# Altium schematic sheet TEST-GPS_RF-REV-C.SchDoc: Test Board for altimeter, RF, GPS,
size 419 x 297 mm; Organization: FFT; Revision: C; SheetNumber: 1; SheetTotal: 1; ID: TESET-GPS_RF
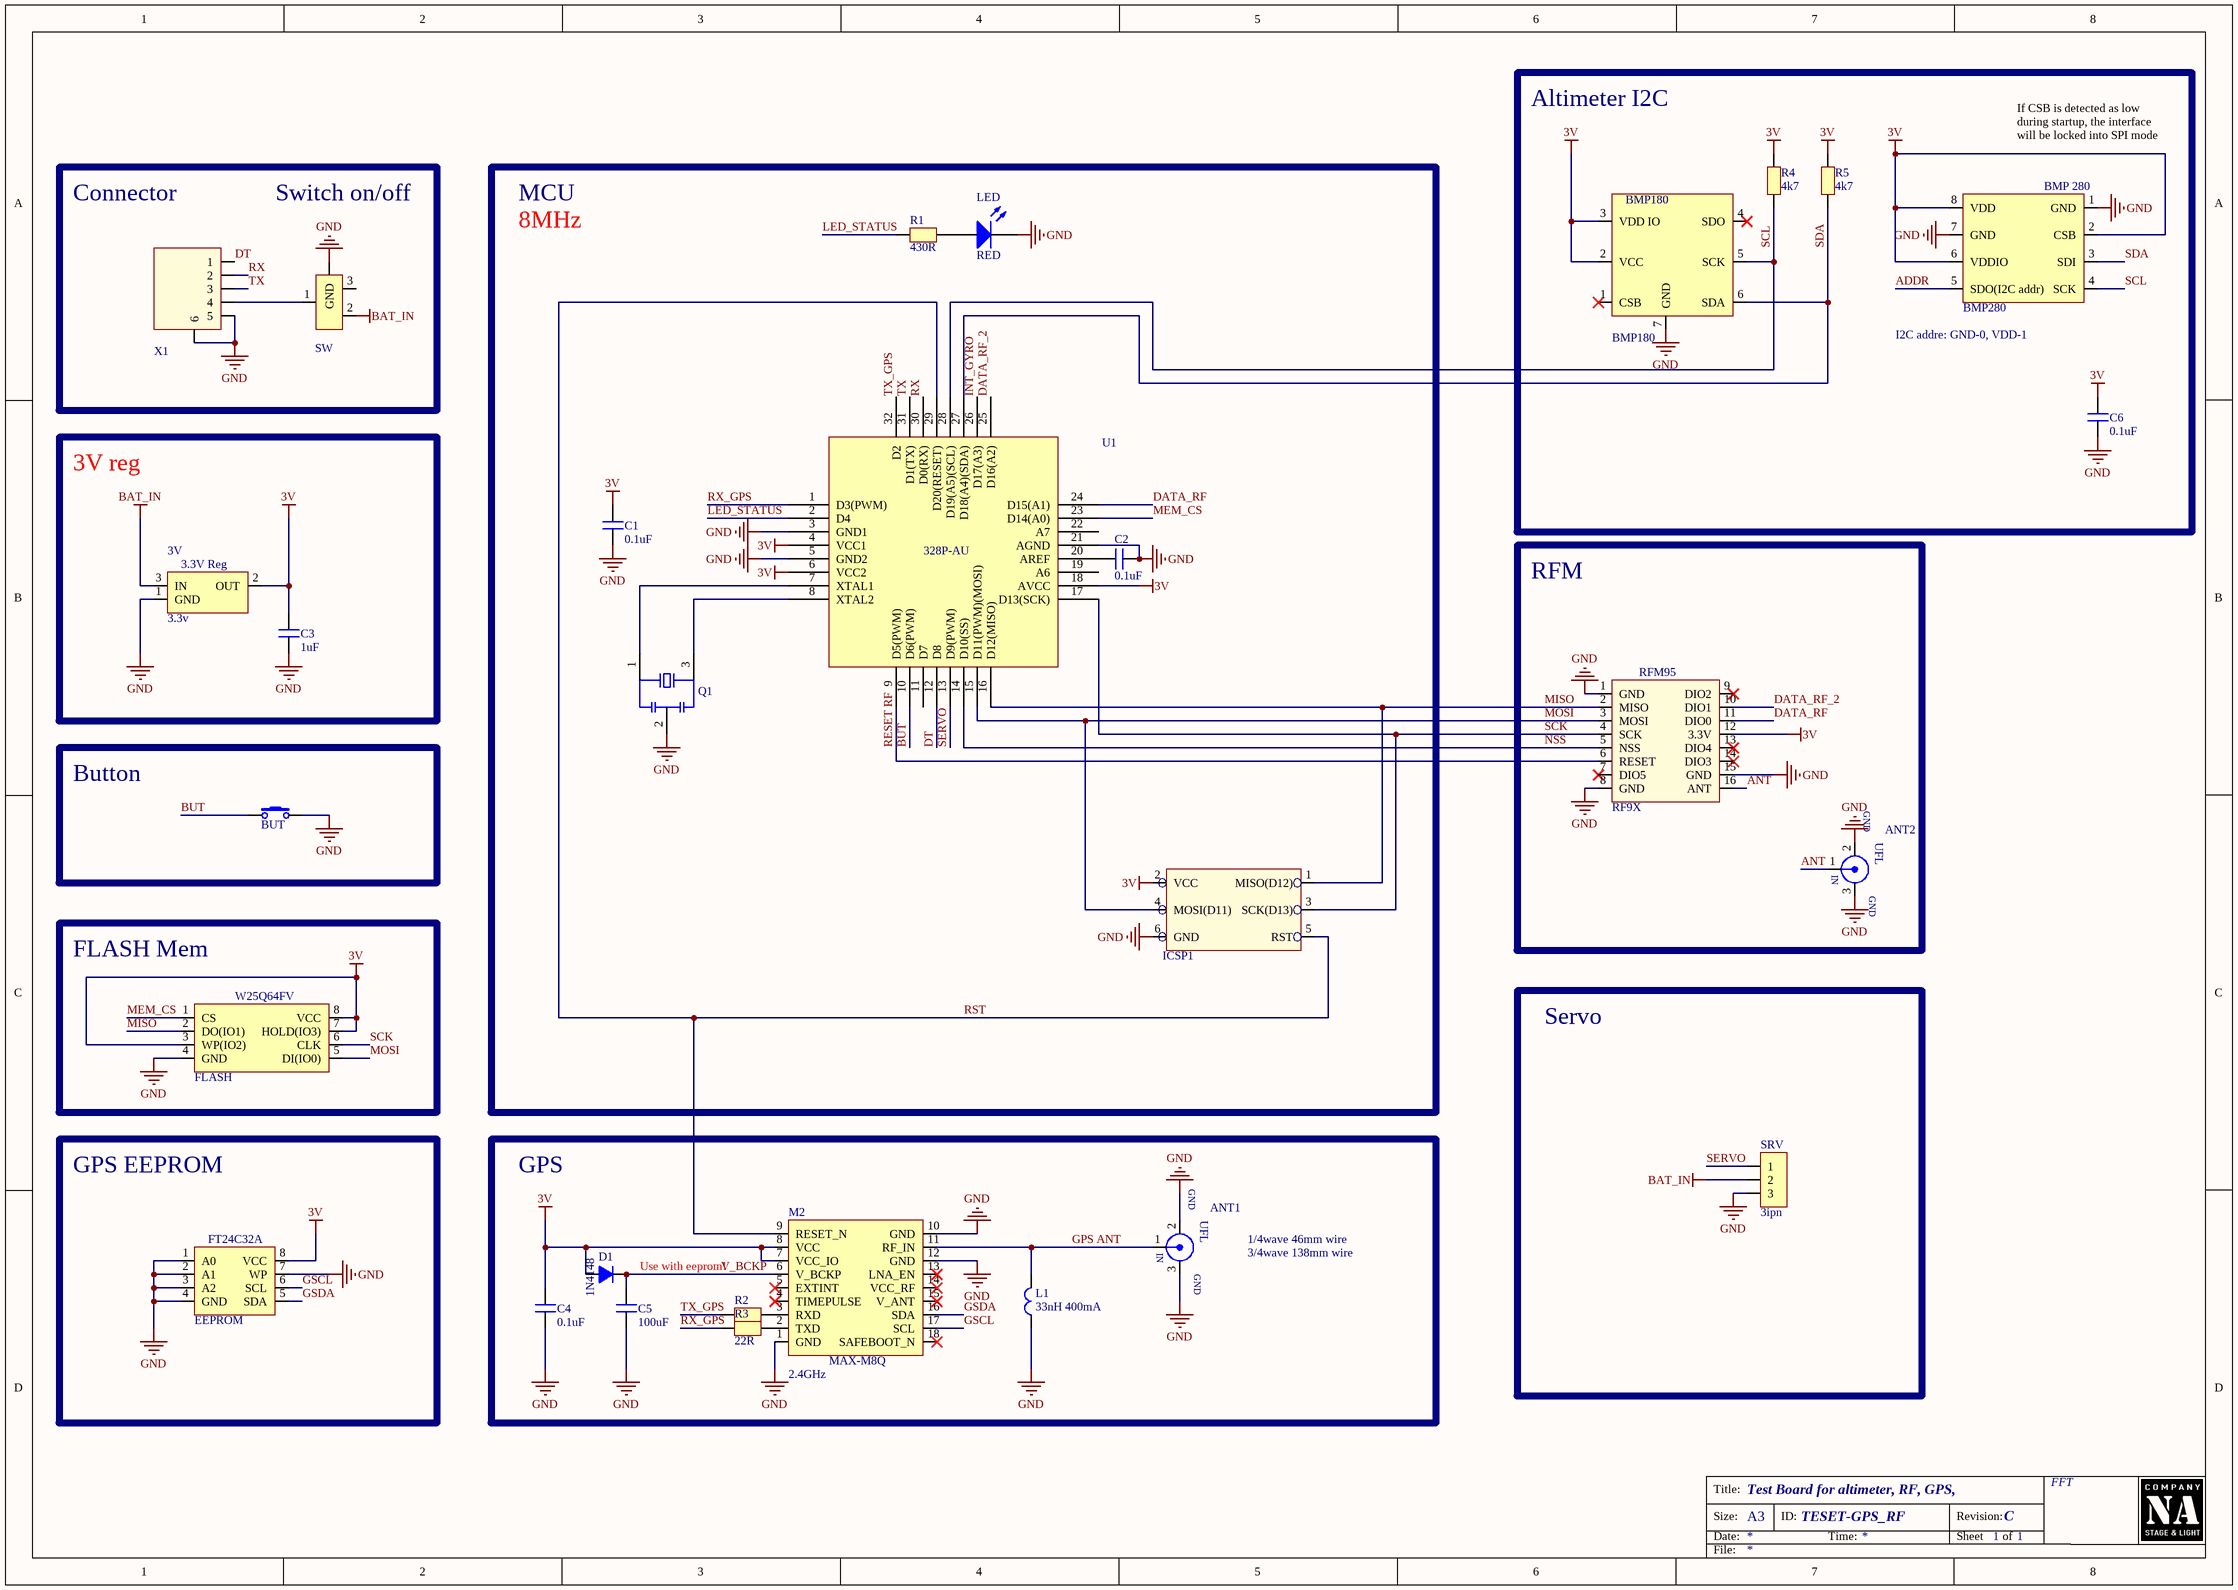
[diagram p0: TEST-GPS_RF-REV-C.SchDoc]

## Parts
3V  3.3v  [SOT23-3]
ANT1  UFL-simple  [UFL]  (value not drawn)
ANT2  UFL-simple  [UFL]  (value not drawn)
BMP180  ± 0.12 hPa equivalent to ±1 m  [BMP180]  (value not drawn)
BMP280  ± 0.12 hPa equivalent to ±1 m  [BMP280]  (value not drawn)
BUT  B3S-1002  [B3S-1002 FFT]  (value not drawn)
C1  0.1uF  [C0603]
C2  0.1uF  [C0603]
C3  1uF  [C0603]
C4  0.1uF  [C0603]
C5  100uF  [C1210]
C6  0.1uF  [C0603]
D1  1N4148  [SOD-323]
EEPROM  32KBit  [TSSOP - 8]  (value not drawn)
FLASH  -  [VSOP8]  (value not drawn)
ICSP1  Progr ICSP  [ICSP prg PAD 2.54mm]  (value not drawn)  (net tie)
L1  33nH 400mA  [L0603]
LED  RED  [LED0603]
M2  2.4GHz  [MAX-M8Q]
Q1  osc 8Mhz CSTCE8M0V53-R0_1  [OSC_CSTCE16M0V53-R0]  (value not drawn)
R1  430R  [0603]
R2  22R  [0603]
R3  22R  [0603]
R4  4k7  [0603]
R5  4k7  [0603]
RF9X  RFM95  [RFM9x]  (value not drawn)
SRV  3ipn  [HDR1x3 angled]
SW  (no value)  [Switch slide]
U1  (no value)  [32-pin QFP 10mm]
X1  1.0mm 5pin  [JST 5pin 1mm]  (value not drawn)

## Blocks framed on the sheet
Altimeter I2C: BMP180 BMP280 C6 R4 R5
3V reg: 3V C3
RFM: ANT2 RF9X
Button: BUT
FLASH Mem: FLASH
Servo: SRV
GPS EEPROM: EEPROM
GPS: ANT1 C4 C5 D1 L1 M2 R2 R3

## Nets
3V: 3V.2(OUT) BMP180.2(VCC) BMP180.3(VDD_IO) BMP280.2(CSB) BMP280.6(VDDIO) BMP280.8(VDD) C1.2 C3.2 C4.1 C6.2 D1.A EEPROM.8(VCC) FLASH.3(WP(IO2)) FLASH.7(HOLD(IO3)) FLASH.8(VCC) ICSP1.2(VCC) M2.7(VCC_IO) M2.8(VCC) R4.2 R5.2 RF9X.12(3.3V) U1.4(VCC1) U1.6(VCC2) U1.18(AVCC)
BAT_IN: 3V.3(IN) SRV.2 SW.2
GND: 3V.1(GND) ANT1.2(OUT) ANT1.3(GND) ANT2.2(OUT) ANT2.3(GND) BMP180.7(GND) BMP280.1(GND) BMP280.7(GND) BUT.1 C1.1 C2.1 C3.1 C4.2 C5.2 C6.1 EEPROM.1(A0) EEPROM.2(A1) EEPROM.3(A2) EEPROM.4(GND) EEPROM.7(WP) FLASH.4(GND) ICSP1.6(GND) L1.1 LED.2 M2.1(GND) M2.10(GND) M2.12(GND) Q1.2(OSC2) RF9X.1(GND) RF9X.8(GND) RF9X.15(GND) SRV.3 SW.4(GND) U1.3(GND1) U1.5(GND2) U1.21(AGND) X1.5 X1.6
ADDR: BMP280.5(SDO(I2C_addr))
ANT: ANT2.1(ANT) RF9X.16(ANT)
BUT: BUT.2 U1.10(D6(PWM))
DATA_RF: RF9X.11(DIO0) U1.24(D15(A1))
DATA_RF_2: RF9X.10(DIO1) U1.25(D16(A2))
DT: U1.12(D8) X1.1
GPS ANT: ANT1.1(ANT) L1.2 M2.11(RF_IN)
GSCL: EEPROM.6(SCL) M2.17(SCL)
GSDA: EEPROM.5(SDA) M2.16(SDA)
INT_GYRO: U1.26(D17(A3))
LED_STATUS: R1.1 U1.2(D4)
MEM_CS: FLASH.1(CS) U1.23(D14(A0))
MISO: FLASH.2(DO(IO1)) ICSP1.1(MISO(D12)) RF9X.2(MISO) U1.16(D12(MISO))
MOSI: FLASH.5(DI(IO0)) ICSP1.4(MOSI(D11)) RF9X.3(MOSI) U1.15(D11(PWM)(MOSI))
NSS: RF9X.5(NSS) U1.14(D10(SS))
RESET RF: RF9X.6(RESET) U1.9(D5(PWM))
RST: ICSP1.5(RST) M2.9(RESET_N) U1.29(D20(RESET))
RX: U1.30(D0(RX)) X1.2
RX_GPS: R3.1 U1.1(D3(PWM))
SCK: FLASH.6(CLK) ICSP1.3(SCK(D13)) RF9X.4(SCK) U1.17(D13(SCK))
SCL: BMP180.5(SCK) BMP280.4(SCK) R4.1 U1.28(D19(A5)(SCL))
SDA: BMP180.6(SDA) BMP280.3(SDI) R5.1 U1.27(D18(A4)(SDA))
SERVO: SRV.1 U1.13(D9(PWM))
TX: U1.31(D1(TX)) X1.3
TX_GPS: R2.1 U1.32(D2)
V_BCKP: C5.1 D1.K M2.6(V_BCKP)
NetC2_2: C2.2 U1.20(AREF)
NetLED_1: LED.1 R1.2
NetM2_2: M2.2(TXD) R3.2
NetM2_3: M2.3(RXD) R2.2
NetQ1_1: Q1.1(OSC1) U1.7(XTAL1)
NetQ1_3: Q1.3(OSC3) U1.8(XTAL2)
NetSW_1: SW.1 X1.4

Not connected (* = marked no-connect by the designer): BMP180 1(CSB)* 4(SDO)*; M2 4(TIMEPULSE)* 5(EXTINT)* 13(LNA_EN)* 14(VCC_RF)* 15(V_ANT)* 18(SAFEBOOT_N)*; RF9X 7(DIO5)* 9(DIO2)* 13(DIO4)* 14(DIO3)*; SW 3; U1 11(D7) 19(A6) 22(A7)

## Notes on the sheet
- If CSB is detected as low
  during startup, the interface will be locked into SPI mode
- Connector
- Switch on/off
- MCU
- 8MHz
- (near BMP280) I2C addre: GND-0, VDD-1
- Use with eeprom!
- 1/4wave 46mm wire
- 3/4wave 138mm wire
- Title:
- Size:
- Date:
- A3
- ID:
- Time:
- Revision:
- Sheet
- of
- File:
- (in symbol 328p-AU-arduino) 328P-AU
- (in symbol UFL - simple) UFL; IN
- (in symbol XC6206P332MR) 3.3V Reg

## Library data of the parts
3V = XC6206P332MR: LDO 3.3V 200mA; Part Footprint: SOT-23-3L; Manufacturer: TOREX; Part Description: LDO 3.3V 0.2A; Value: 3.3v; Part Number: XC6206P332MR; Price: 0.06; LCSC Part #: C5446
ANT1 ANT2 = UFL - simple: Connector; Manufacturer: Aliexpress; Part Description: ufl connector; Part Footprint: SMD; Part Number: 123123; Price: 0.1
BMP180 = BMP 180: Pressure sensor BMP 180; Part Description: BMP 180 Pressure sensor 1.62-3.6V; Manufacturer: BOSCH; Part Footprint: 3.6x3.8x0.93mm; Part Number: BMP 180; Value: ± 0.12 hPa equivalent to ±1 m; Price: 0.3
BMP280 = BMP 280: Pressure sensor BMP 280; Part Description: BMP 280 Pressure 3.4 μA,0.1 μA(sleep),1.2 ... 3.6 V; Manufacturer: BOSCH; Part Number: 828-1064-1-ND - BMP 280; Part Footprint: 2.0 x 2.5 x 0.95 mm³ 8-Pin LGA with metal; Value: ± 0.12 hPa equivalent to ±1 m; Price: 0.3
BUT = B3S-1002: Single pole tactile switch, H=4.2mm; Part Description: Sealed tactile switch, 1 to 50 mA, 5 to 24 VDC; Manufacturer: Omron; PartFootprint: SMD 6x6mm; Value: B3S-1002; Temperature: -25÷70°C; Part Number: B3S-1002; Packing: *; Tape width: *; MSD level: *
C1 C2 C4 C6 = C0603_0.1uF_50V: Part Number: CL10B104KB8NNNC; Part Description: CAP 0.1uF ±10% 50V X7R -55÷125°C 0603; Manufacturer: SAMSUNG; PartFootprint: 0603; Value2: 104; Percent: ±10%; Voltage: 50V; Dielectric: X7R; Name: CAP; Packing: Tape; MSD level: 2; Value: 0.1uF; Temperature: -55÷125°C; Tape width: 8mm
C3 = C0603_1uF_10V: Part Number: CL10A105KP8NNNC; Part Description: CAP 1uF ±10% 10V X5R -55÷85°C 0603; Manufacturer: SAMSUNG; PartFootprint: 0603; Value2: 105; Percent: ±10%; Voltage: 10V; Dielectric: X5R; Name: CAP; Packing: Tape; MSD level: 2; Value: 1uF; Temperature: -55÷85°C; Tape width: 8mm
C5 = C1210_100uF_250V: C1210_10uF_250V; Part Number: CL32A107MPVNNNE; Manufacturer: Samsung; PartFootprint: 1210; Value2: 102; Percent: ±10%; Voltage: 250V; Dielectric: X7R; Value: 100uF; Part Description: =Name+' '+Value+' '+Percent+' '+Voltage+' '+Dielectric+' '+Temperature+' '+PartFootprint; Temperature: -55÷125°C; Price: 0.06
D1 = 1N4148WS-7-F: Small signal diode; Manufacturer: Diodes Incorporated; PartFootprint: SOD-323; Part Description: ='Small signal DIODE 75V 300mA '+Temperature+' '+PartFootprint; Part Number: 1N4148WS-7-F; LCSC Part #: C2128; Price: 0.01
EEPROM = FT24C32A: Memory EEPROM for GPS; Part Description: EEPROM 32KBit; Manufacturer: FMD; Part Number: FT24C32A-ETR-T; Part Footprint: TSSOP-8; Value: 32KBit; Price: 0.08; LCSC Part #: C232881
FLASH = W25Q64FV: Memory Flash SPI 64MBit; Part Description: Flash SPI 64MBit memory; Manufacturer: Windbond; Part Footprint: SOP8; Part Number: W25Q64FV; Value: -; Price: 0.3
ICSP1 = Progr ICSP: PAD prog
L1 = L0603_33nH: Inductor; Part Number: 744786133A; Manufacturer: Murata; Part Footprint: 0603; Percent: ±5%; Value: 33nH 400mA; Part Description: ='RES '+Value+' '+Percent+' '+Wattage+' '+Temperature+' '+PartFootprint; Price: 0.025 €
LED = KT-0603R: LED 0603 chip; Manufacturer: Hubei KENTO Elec; Part Description: RED LED; Part Footprint: 0603; Part Number: KT-0603R; Value: RED; Price: 0.01; LCSC Part #: C2286
M2 = MAX-M8Q: GPS module; Manufacturer: uBlox; Part Description: MAX-M8Q -40÷85°C PCB 10x9.6mm; PartFootprint: PCB 10x9.6mm; Packing: Tray; Value: 2.4GHz; Temperature: -40÷85°C; MSD level: *; Price: 4.00
Q1 = osc 8Mhz CSTCE8M0V53-R0_1: 8MHz Ceramic Resonator Built in Cap 15pF ±0.3% -20°C ~ 80°C SMD; Manufacturer: Murata; Part Footprint: SMD-3 Murata; Price: 0.37; Value: 8MHz; Part Description: 8MHz Ceramic Resonator Built in Cap 15pF ±0.3% -20°C ~ 80°C SMD; Part Number: CSTCE8M0V53-R0_1
R1 = R0603_430: SMD resistor; Part Number: RC0603FR-07430RL; Manufacturer: Yageo; Part Description: RES 430R ±1% 0.1W -55÷155°C 0603; Percent: ±1%; Wattage: 0.1W; Packing: Tape; Value: 430R; Value2: 430R; Temperature: -55÷155°C; PartFootprint: 0603; Tape width: 8mm; MSD level: *
R2 R3 = R0603_22: SMD resistor; Part Number: CRCW060322R0FKTABC; Manufacturer: VISHAY; Part Description: RES 22R ±1% 0.1W -55÷125°C 0603; Percent: ±1%; Wattage: 0.1W; Packing: Tape; Value: 22R; Temperature: -55÷125°C; PartFootprint: 0603; Tape width: 8mm; MSD level: *
R4 R5 = R0603_4k7: SMD resistor; Part Number: SMD0603-4K7-1%; Manufacturer: Yageo; Part Description: RES 4k7 ±1% 0.1W -55÷155°C 0603; Percent: ±1%; Wattage: 0.1W; Packing: Tape; Value: 4k7; Value2: 4K7; Temperature: -55÷155°C; PartFootprint: 0603; Tape width: 8mm; MSD level: *
RF9X = RFM95: RF Transceiver; Manufacturer: Hope RF Electronics; Part Description: RF transveiver; Part Footprint: SMD PCB 16x16mm; Value: 315/433/868/915MHz 100mW; Part Number: RFM95; Price: 4.40
SRV = Header 3x1: Header 3-Pin, 2.54mm; Manufacturer: Connfly; Part Description: 1x3 IDC male header; Part Footprint: THT; Part Number: DS1021-1*3SF1-1; Value: 3pin; Price: 0.1
SW = MK12C02: Switch; Part Description: Slide switch; Manufacturer: Xiejia; Part Footprint: SMD; Temperature: -40÷85°C; Part Number: MK12C02; Price: 0.05
U1 = 328p-AU-arduino: CPU; Part Number: ATmega 328p-AU; Manufacturer: TI; Part Footprint: QFN32; Part Description: CPU; Price: 1.7
X1 = SM05B-SRSS-TB: Connector 5p hor 1mm; Manufacturer: JST; Part Footprint: SMD; Part Description: 1.00 mm pitch connector; Value: 1.0mm 5pin; Part Number: SM05B-SRSS-TB; Price: 0.30